# Altium project as5311-module.PrjPcb
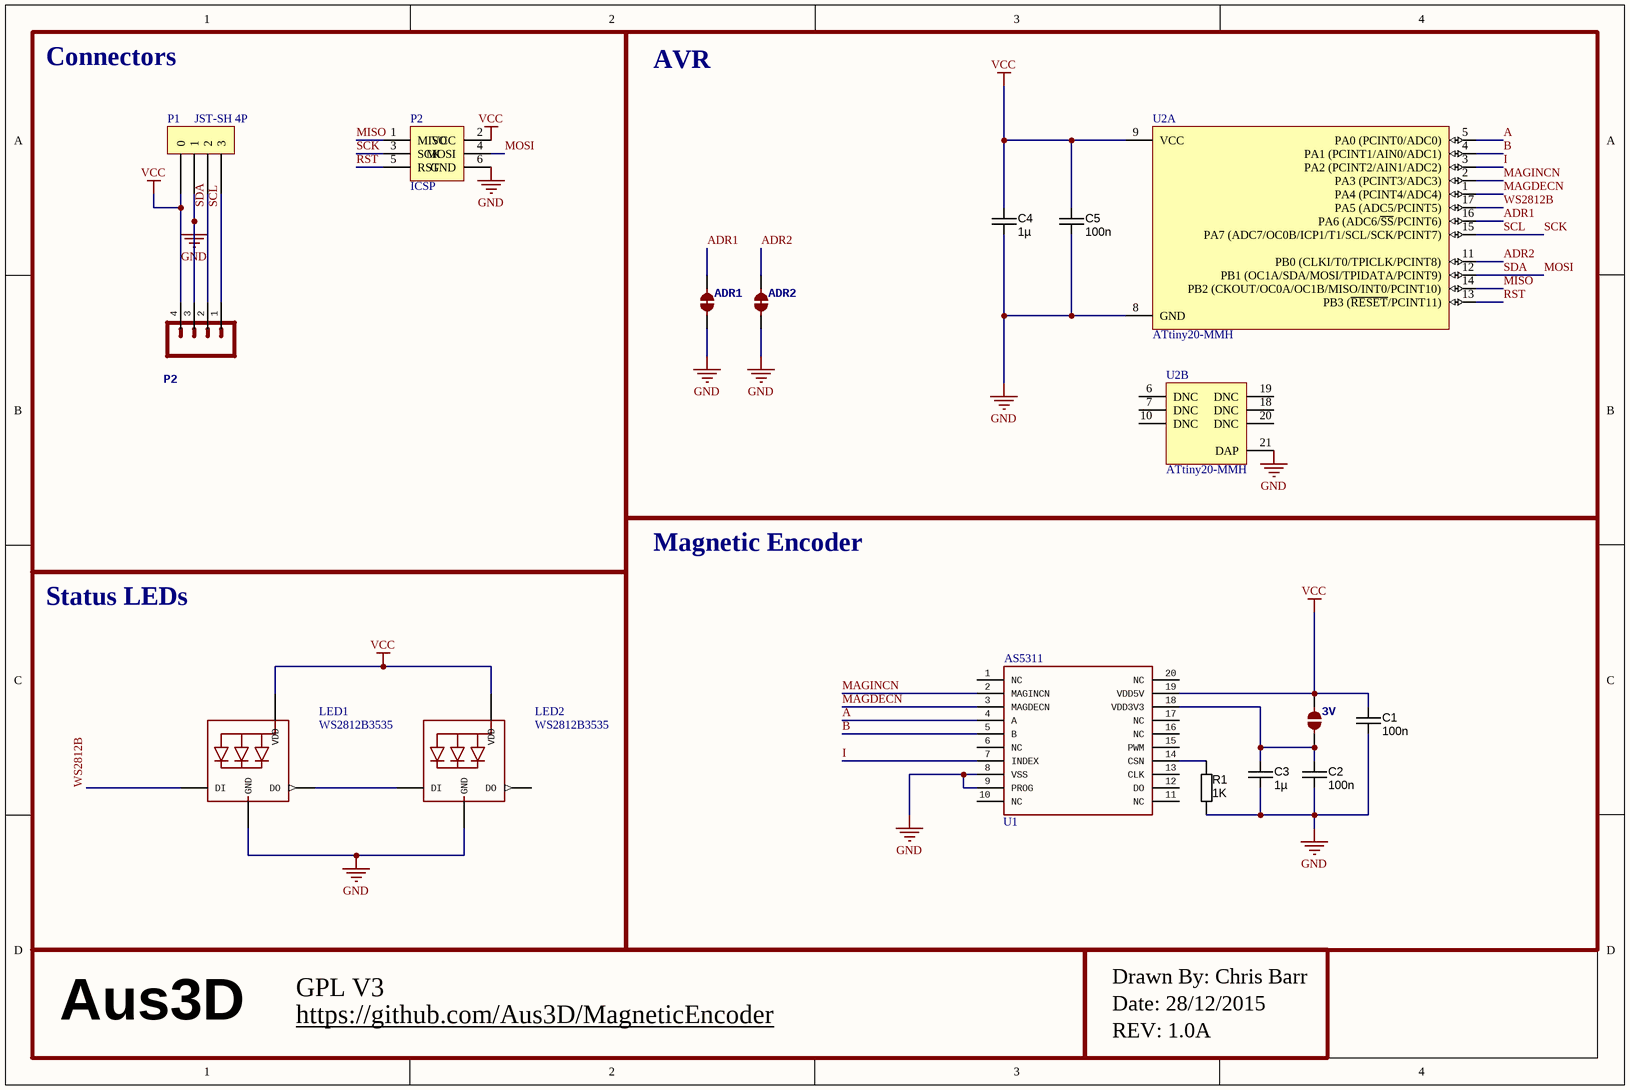
[diagram p0: as5311-module.SchDoc]
1 sheet, 16 parts. Net scope: global (net labels, ports and power ports of the same name join across sheets).
Board file: as5311-module.PcbDoc

## Sheet as5311-module.SchDoc
size 304 x 203 mm

### Parts
(Parts that share a designator on the sheet are numbered #1, #2 ... from top to bottom, then left to right.)
3V  JUMPER-PAD-2-NO  [PAD-JUMPER-2-NO_NO_SILK]  (value not drawn)
ADR1  JUMPER-PAD-2-NC_BY_TRACE  [PAD-JUMPER-2-NC_BY_TRACE_YES_SILK]  (value not drawn)
ADR2  JUMPER-PAD-2-NC_BY_TRACE  [PAD-JUMPER-2-NC_BY_TRACE_YES_SILK]  (value not drawn)
C1  value 100n  [CAPC1608X90N]  (hidden comment: approved sub OK)
C2  value 100n  [CAPC1608X90N]  (hidden comment: approved sub OK)
C3  value 1µ  [CAPC1608X90N]  (hidden comment: approved sub OK)
C4  value 1µ  [CAPC1608X90N]  (hidden comment: approved sub OK)
C5  value 100n  [CAPC1608X90N]  (hidden comment: approved sub OK)
LED1  WS2812B3535  [LED3535]
LED2  WS2812B3535  [LED3535]
P1  JST-SH 4P  [SM04B-SRSS-TB]
P2#1  ICSP  [ICSP Pads - SMD]
P2#2  Header 4Standard 4-pin 0.1" header. Use with straight break away headers (SKU : PRT-00116), right angle break away headers (PRT-00553), swiss pins (PRT-00743), machine pins (PRT-00117), and female headers (PRT-00115). Molex polarized connector foot print use with SKU : PRT-08231 with associated crimp pins and housings. 1MM SMD Version SKU: PRT-10208  [1X04_LOCK]  (value not drawn)
R1  value 1K  [RESC1608X55N]  (hidden comment: Thick Film)
U1  AS5311  [TSSOP-20]
U2  ATtiny20-MMH  [20M2_N]  (parts A,B of 2)

### Blocks framed on the sheet
Connectors: P1 P2#1 P2#2
AVR: ADR1 ADR2 C4 C5 U2
Status LEDs: LED1 LED2
Magnetic Encoder: 3V C1-C3 R1 U1

### Nets
GND: ADR1.1 ADR2.1 C1.2 C2.2 C3.2 C4.2 C5.2 LED1.4(GND) LED2.4(GND) P1.1 P2#1.6(GND) P2#2.3 R1.2 U1.8(VSS) U1.9(PROG) U2.8(GND) U2.21(DAP)
VCC: 3V.2 C1.1 C4.1 C5.1 LED1.2(VDD) LED2.2(VDD) P1.0 P2#1.2(VCC) P2#2.4 U1.19(VDD5V) U2.9(VCC)
A: U1.4(A) U2.5(PA0_(PCINT0/ADC0))
ADR1: ADR1.2 U2.16(PA6_(ADC6/~{SS}/PCINT6))
ADR2: ADR2.2 U2.11(PB0_(CLKI/T0/TPICLK/PCINT8))
B: U1.5(B) U2.4(PA1_(PCINT1/AIN0/ADC1))
I: U1.7(INDEX) U2.3(PA2_(PCINT2/AIN1/ADC2))
MAGDECN: U1.3(MAGDECN) U2.1(PA4_(PCINT4/ADC4))
MAGINCN: U1.2(MAGINCN) U2.2(PA3_(PCINT3/ADC3))
MISO: P2#1.1(MISO) U2.14(PB2_(CKOUT/OC0A/OC1B/MISO/INT0/PCINT10))
MOSI: P1.2 P2#1.4(MOSI) P2#2.2 U2.12(PB1_(OC1A/SDA/MOSI/TPIDATA/PCINT9))  [also labelled SDA]
RST: P2#1.5(RST) U2.13(PB3_(~{RESET}/PCINT11))
SCK: P1.3 P2#1.3(SCK) P2#2.1 U2.15(PA7_(ADC7/OC0B/ICP1/T1/SCL/SCK/PCINT7))  [also labelled SCL]
WS2812B: LED1.1(DI) U2.17(PA5_(ADC5/PCINT5))
Net3V_1: 3V.1 C2.1 C3.1 U1.18(VDD3V3)
NetLED1_3: LED1.3(DO) LED2.1(DI)
NetR1_1: R1.1 U1.14(CSN)

Not connected (* = marked no-connect by the designer): LED2 3(DO); U1 1(NC) 6(NC) 10(NC) 11(NC) 12(DO) 13(CLK) 15(PWM) 16(NC) 17(NC) 20(NC); U2 6(DNC) 7(DNC) 10(DNC) 18(DNC) 19(DNC) 20(DNC)

### Notes on the sheet
- Aus3D
- https://github.com/Aus3D/MagneticEncoder
- GPL V3
- Drawn By: Chris Barr
- Date: 28/12/2015
- REV: 1.0A

### Library data of the parts
C1 C2 C5 = CAPC_100n_0603_X7R_50V_10%: Capacitor SMD Cer 100nF 10% 50V X7R 0603; Manufacturer 1: AVX Corporation; Manufacturer Part Number 1: 06035C104KAT2A; Ratings: 50V; X7R; Material: ceramic; SCDType: spec; Manufacturer 2: TDK Corporation; Manufacturer Part Number 2: C1608X7R1H104K; Package / Case: 0603 (1608 Metric); Tolerance: ±10%; Supplier 1: Digi-Key; Supplier Part Number 1: 478-5052-1-ND; ComponentLink1URL: http://www.avx.com/docs/Catalogs/cx7r.pdf; ComponentLink1Description: http://www.avx.com/docs/Catalogs/cx7r.pdf; Supplier 2: Digi-Key; Supplier Part Number 2: 445-1314-1-ND; ComponentLink2URL: http://product.tdk.com/capacitor/mlcc/en/documents/mlcc_commercial_general_en.pdf; ComponentLink2Description: http://product.tdk.com/capacitor/mlcc/en/documents/mlcc_commercial_general_en.pdf
C3 C4 = CAPC_1u_0603_X7R_16V_10%: Capacitor SMD Cer 1uF 10% 16V X7R 0603; Manufacturer 1: TDK Corporation; Manufacturer Part Number 1: C1608X7R1C105K; Ratings: 16V; X7R; Material: ceramic; SCDType: spec; Package / Case: 0603 (1608 metric); Tolerance: ±10%; Supplier 1: Digi-Key; Supplier Part Number 1: 445-1604-1-ND; ComponentLink1URL: http://product.tdk.com/capacitor/mlcc/en/documents/mlcc_commercial_general_en.pdf; ComponentLink1Description: http://product.tdk.com/capacitor/mlcc/en/documents/mlcc_commercial_general_en.pdf
LED1 LED2 = WS2812B3535: Manufacturer 1: DONGGUANG OPSCO OPTOELECTRONICS CO., LTD; Manufacturer Part Number 1: SK6812MINI
P1 = SM04B-SRSS-TB: Supplier 1: Digi-Key; Supplier Part Number 1: 455-1804-1-ND
P2#1 = Header 3X2: Header, 3-Pin, Dual row; LatestRevisionDate: 17-Jul-2002; LatestRevisionNote: Re-released for DXP Platform.; Publisher: Altium Limited
P2#2 = M04LOCK
R1 = RES_1K_0603_5%: Resistor SMD chip 1k Ohm 0.1W 5% 0603; Manufacturer 1: Yageo; Manufacturer Part Number 1: RC0603JR-071KL; Ratings: 1/10 W; SCDType: spec; Package / Case: 0603 (1608 metric); Tolerance: ±5%; Material: Thick Film; Supplier 1: Digi-Key; Supplier Part Number 1: 311-1.0KGRCT-ND; Supplier 2: Digi-Key; Supplier Part Number 2: 541-1.0KGCT-ND; Manufacturer 2: Vishay Dale; Manufacturer Part Number 2: CRCW06031K00JNEA; ComponentLink2URL: http://www.vishay.com/doc?20008; ComponentLink2Description: http://www.vishay.com/doc?20008; ComponentLink1URL: http://www.yageo.com/documents/recent/PYu-RC0603_51_RoHS_L_4.pdf; ComponentLink1Description: http://www.yageo.com/documents/recent/PYu-RC0603_51_RoHS_L_4.pdf
U1 = AS5311: AMS's AS5311 linear hall-effect encoder.
U2 = ATtiny20-MMH: 8-bit AVR Microcontroller, 1.8-5.5V, 12MHz, 2KB Flash, 128 Bytes SRAM, 12 GPIO pins, 20-pin VQFN, Industrial Grade (-40°C to 85°C), Pb-Free; DatasheetVersion: revB, Apr-2011; PackageVersion: revB, Oct-2008; PackageReference: 20M2; PackageDescription: 20-pad, 3x3x0.85mm Body, Pitch 0.45mm, 1.55x1.55mm Exposed Pad, Plastic Very Thin QFN Package (VQFN); ComponentLink1Description: Manufacturer URL; ComponentLink1URL: http://www.atmel.com/; ComponentLink2Description: ATtiny20 Datasheet; ComponentLink2URL: http://www.atmel.com/dyn/resources/prod_documents/doc8235.pdf; ComponentLink3Description: ATtiny20 Summary; ComponentLink3URL: http://www.atmel.com/dyn/resources/prod_documents/8235S.pdf